# EAGLE design team_flag (EAGLE 6.5.0)
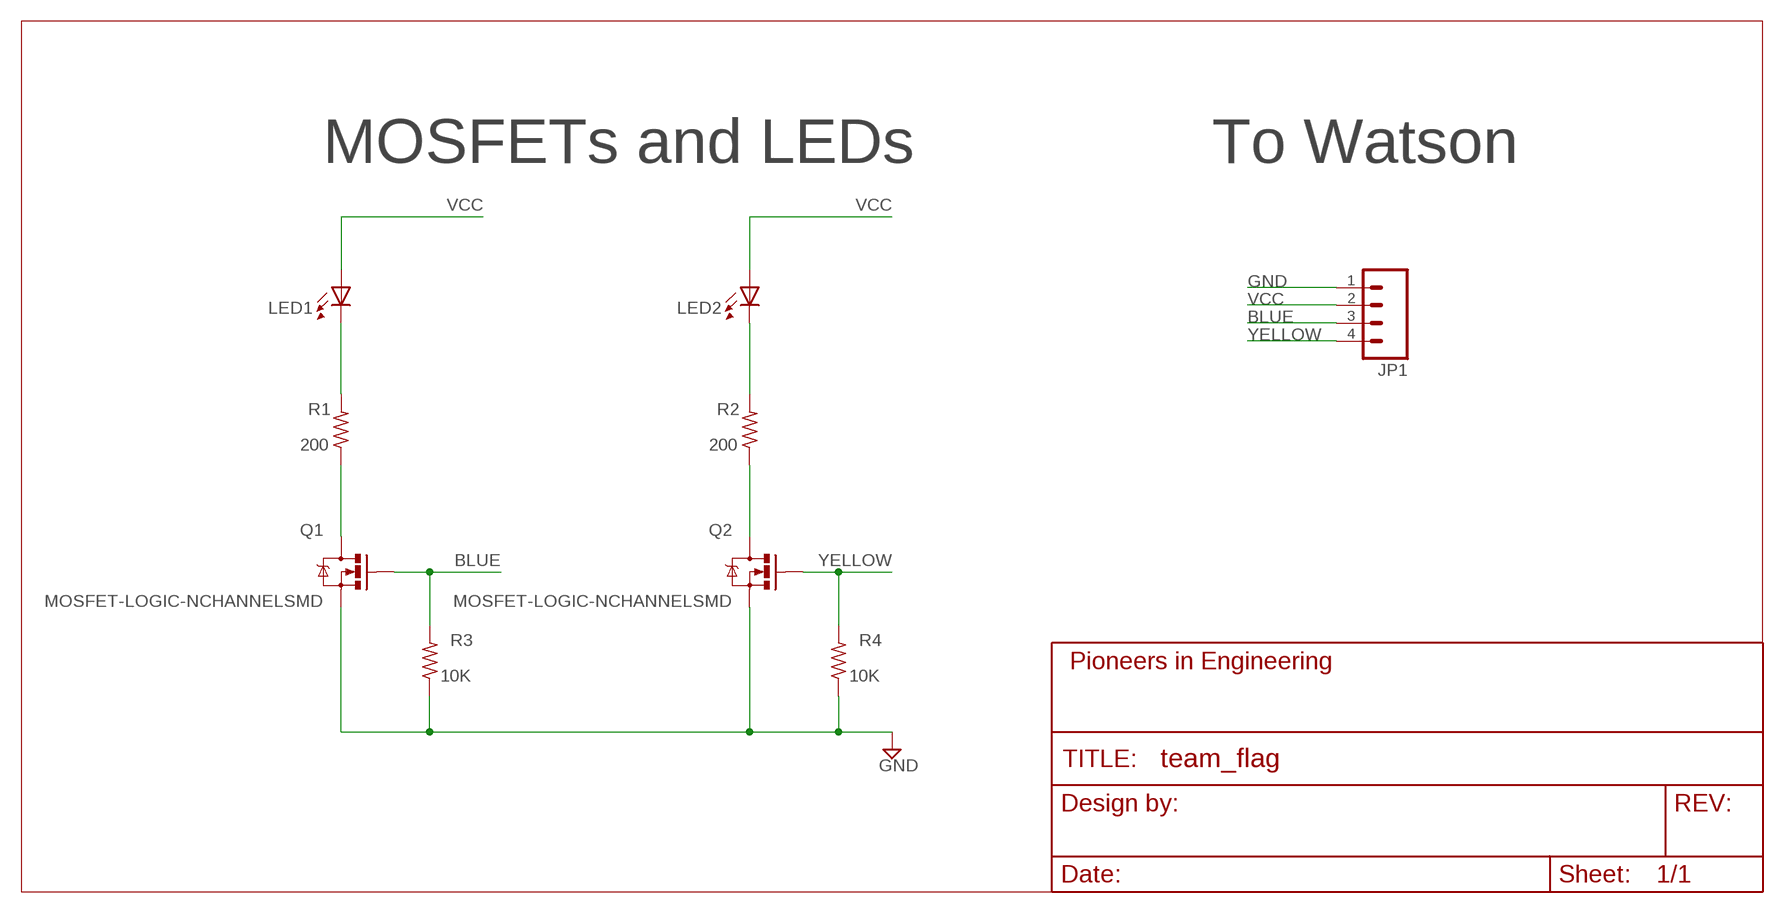
[diagram p0: schematic, sheet 1]
FRAME1 (FRAME-LETTER): AUTHOR: Aravind K., Jared P.; REVISION: C

## Parts
JP1  M041X04-MTA  [1X04-MTA]
LED1  LEDLED5MM-NOFLAT  [LED5MM-NOFLAT]
LED2  LEDLED5MM-NOFLAT  [LED5MM-NOFLAT]
Q1  MOSFET-LOGIC-NCHANNELSMD  [SOT23-3-LOGIC]
Q2  MOSFET-LOGIC-NCHANNELSMD  [SOT23-3-LOGIC]
R1  200  R-US_R0603  [R0603]
R2  200  R-US_R0603  [R0603]
R3  10K  R-US_R0603  [R0603]
R4  10K  R-US_R0603  [R0603]

## Nets
BLUE: JP1.3 Q1.1(G) R3.2
BSOURCE: Q1.3(D) R1.1
GND: JP1.1 Q1.2(S) Q2.2(S) R3.1 R4.1
N$2: LED1.K(C) R1.2
N$3: LED2.K(C) R2.2
VCC: JP1.2 LED1.A LED2.A
YELLOW: JP1.4 Q2.1(G) R4.2
YSOURCE: Q2.3(D) R2.1

## Notes on the sheet
- MOSFETs and LEDs | To Watson

## Library data of the parts
JP1 = pie:M04: 4-pin 0.1-inch header and MTA connector; PARTNUMBER: A1922-ND
LED1 LED2 = pie:LED: LEDs Standard schematic elements and footprints for 5mm, 3mm, 1206, and 0603 sized LEDs. 5mm - Spark Fun Electronics SKU : COM-00529 (and others)
Q1 Q2 = pie:MOSFET-LOGIC-NCHANNEL: N-Type Logic-Level MOSFET, SOT23-3 Package Logic-level MOSFET with low threshold voltage, used on Team Flag.; PIE_DIGIKEY-PN: DMN65D8L-7DICT-ND
R1-R4 = rcl:R-US_: RESISTOR, American symbol

## Board
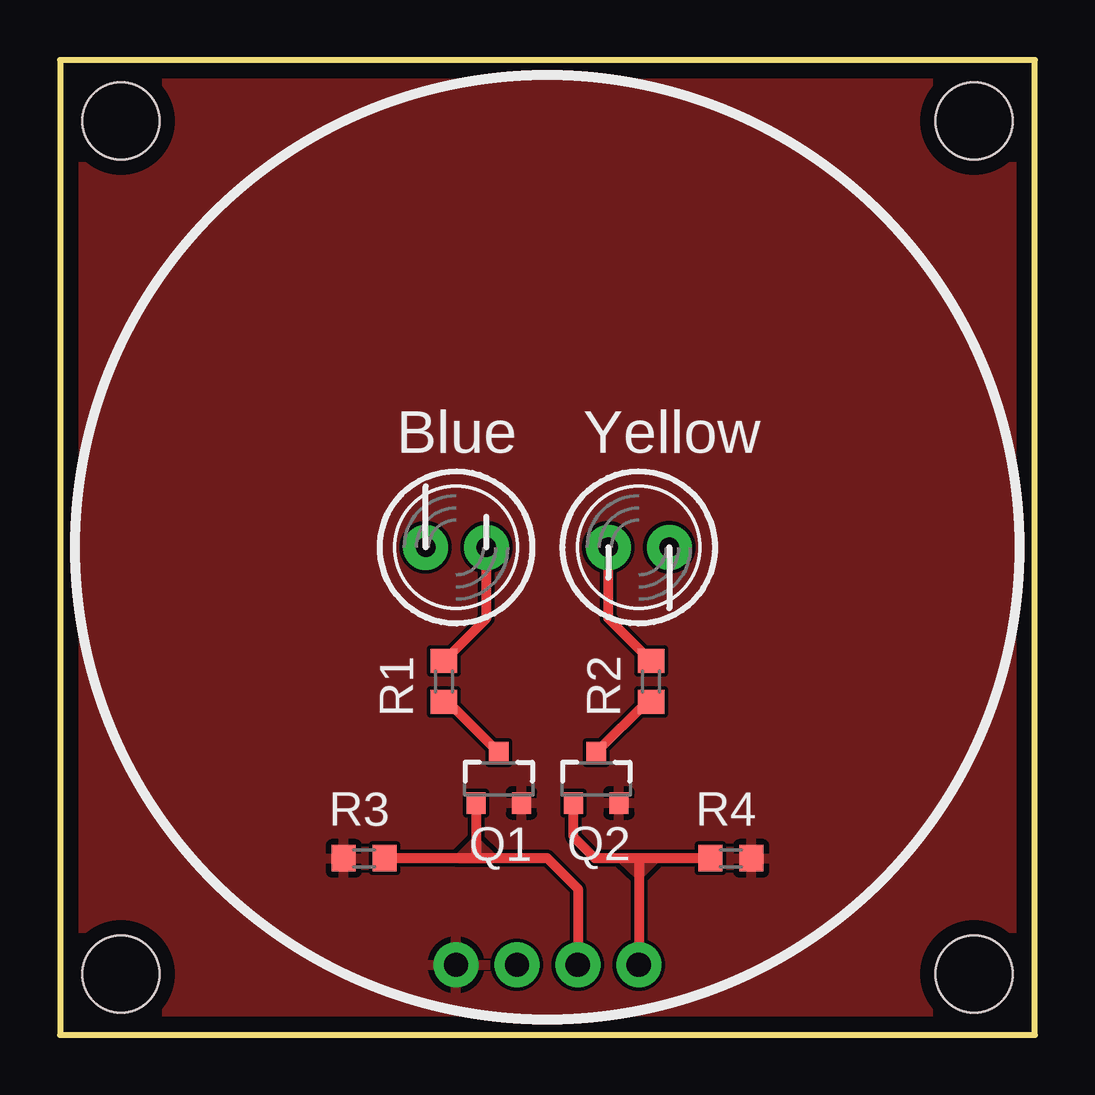
[diagram p1: board, top side]
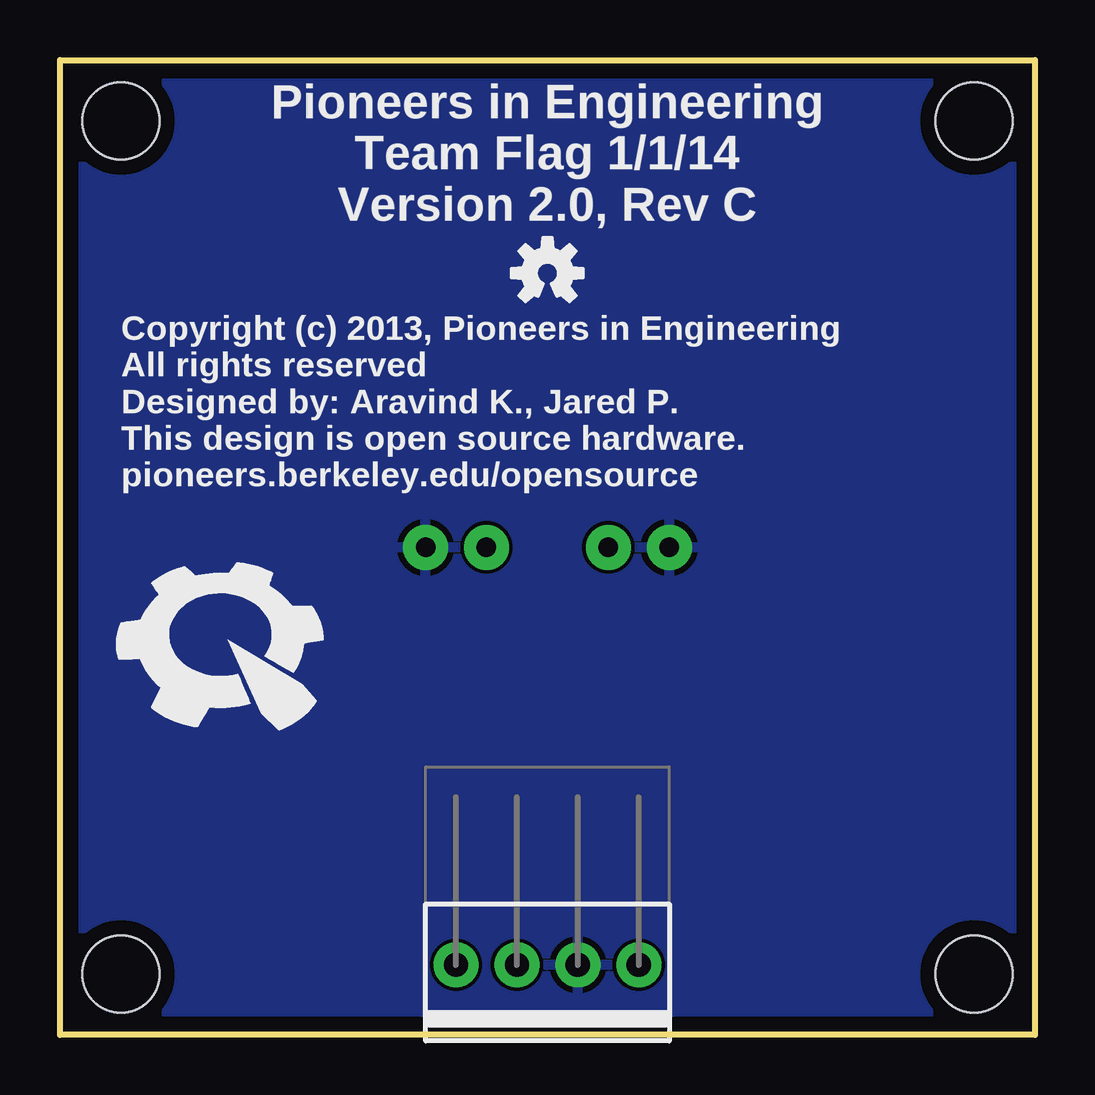
[diagram p2: board, bottom side, seen from below]

Size 40.64 x 40.64 mm. Coordinates in mm from the lower left corner, seen from the top.
Outline: 0,0 40.64,0 40.64,40.64 0,40.64 0,0
Copper layers (1*16): Top 2mil / dielectric 9mil / Bottom 2mil
Design rules "advancedcircuits-33each-pie": minimum track width 6mil, minimum drill 15mil, track to track 6mil, track to pad 10mil, pad to pad 6mil, via to via 6mil, smd to smd 6mil, copper to edge 25mil, drill to drill 7mil, minimum pad ring 7mil, minimum via ring 7mil, stop-mask expansion 3mil, vias tented up to drill 0mil, thermal gap 10mil
Holes 3.2 mm at 2.54,38.1 2.54,2.54 38.1,2.54 38.1,38.1

### Footprints (pad centres in the part's own frame; a part is rotated, then mirrored left to right if it is on the bottom)
1X04-MTA = drill 1.016 pad 1.88: 1 -3.81,0; 2 -1.27,0; 3 1.27,0; 4 3.81,0
LED5MM-NOFLAT = drill 0.813 pad 1.88: A -1.27,0; K 1.27,0
SOT23-3-LOGIC = smd 0.8 x 0.9: 1 -0.95,-1; 2 0.95,-1; 3 0,1.1
R0603 = smd 1 x 1.1: 1 -0.85,0; 2 0.85,0

### Placement (x,y rotation side)
JP1  20.32,2.92 180 bottom
LED1  16.51,20.32 0 top
LED2  24.13,20.32 180 top
Q1  18.29,10.67 0 top
Q2  22.35,10.67 0 top
R1  16,14.73 90 top
R2  24.64,14.73 90 top
R3  12.67,7.37 0 top
R4  27.97,7.37 180 top
U$1  [PIE-LOGO-SMALL]  33.66,16.51 0 bottom
U$2  [OSHW-LOGO-S]  20.32,31.75 0 bottom

### Tracks (layer width: path | path; a pad name or v marks a point on that pad's centre or on a via)
BLUE
  Top 0.406: 17.3,7.37 20.32,7.37 21.59,6.1 JP1.3 | 17.3,7.37 R3.2 | Q1.1 17.34,7.41 17.3,7.37
  pour Top: 18.06,7.37 17.32,8.08 16.61,7.37
BSOURCE
  Top 0.406: R1.1 16.17,13.88 Q1.3
GND
  pour Top (rank 2): 0,0 40.64,0 40.64,40.64 0,40.64
N$2
  Top 0.406: R1.2 17.78,17.36 LED1.K
N$3
  Top 0.406: R2.2 22.86,17.36 LED2.K
VCC
  pour Bottom: 0,0 40.64,0 40.64,40.64 0,40.64
YELLOW
  Top 0.406: R4.2 24.11,7.37 | 24.11,7.37 22.3,7.37 21.41,8.26 21.41,9.66 Q2.1 | 24.11,7.37 24.13,7.34 JP1.4
  pour Top: 23.39,7.37 24.13,6.65 24.84,7.37
YSOURCE
  Top 0.406: R2.1 24.47,13.88 Q2.3

### Text on the board
tPlace: Blue | Yellow
bPlace: Pioneers in Engineering / Team Flag 1/1/14 / Version 2.0, Rev C | Copyright (c) 2013, Pioneers in Engineering / All rights reserved / Designed by: Aravind K., Jared P. / This design is open source hardware. / pioneers.berkeley.edu/opensource
bValues: GND | VCC | BLUE | YELLOW